# Altium schematic sheet SSD1306_v2_SCH.SchDoc
size A4; SheetNumber: 1; SheetTotal: 1
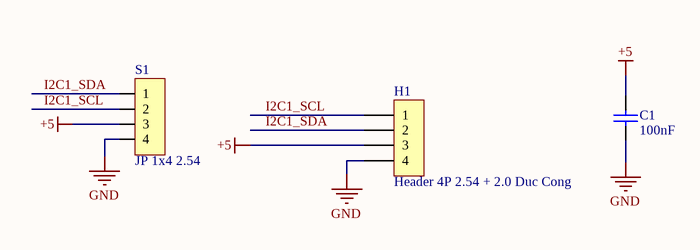
[diagram p0: SSD1306_v2_SCH.SchDoc]

## Parts
C1  100nF  [tu 0603]
H1  Header 4P 2.54 + 2.0 Duc Cong  [Header 4P DC 2.54 + 2.0]
S1  JP 1x4 2.54  [SSD1306_0.96]

## Nets
+5: C1.1 H1.3 S1.3
GND: C1.2 H1.4 S1.4
I2C1_SCL: H1.1 S1.2
I2C1_SDA: H1.2 S1.1

## Library data of the parts
C1 = Tu 0603 104 50V 10%: Dán; Don_Vi: Con; So_Chan: 2; Ten_Linh_Kien: Tụ 0603 104-100nF 10% 50V; Ma_Hang: MH004568; Chung_Loai: Dán; Kieu_Chan: *
H1 = Header 4P 2.54 + 2.0 Duc Cong: Cắm; Ten_Linh_Kien: Header 4P XH2.54-4P Đực Cong; Don_Vi: Con; Ma_Hang: MH001310; Chung_Loai: Cắm
S1 = SSD1306_0.96: Cắm; Ten_Linh_Kien: Jump Đơn Đực 2.54MM 1x40P Thẳng 11MM; Don_Vi: Con; Ma_Hang: MH000903; Ghi_Chu: *; Kieu_Chan: *; Chung_Loai: Cắm